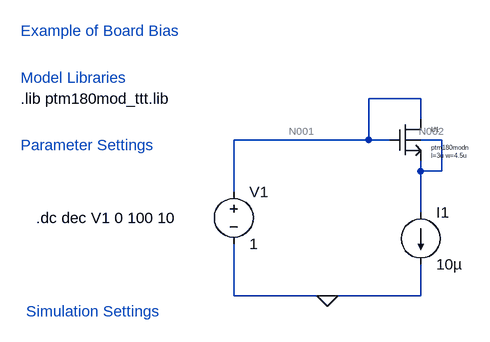
[diagram p0: schematic board_bias.asc]
board_bias.asc, the LTspice schematic file:
Version 4
SHEET 1 3284 784
WIRE 256 -96 176 -96
WIRE 256 -64 256 -96
WIRE 176 -32 176 -96
WIRE 176 -32 -32 -32
WIRE 208 -32 176 -32
WIRE 288 -32 256 -32
WIRE 256 16 256 0
WIRE 288 16 288 -32
WIRE 288 16 256 16
WIRE -32 48 -32 -32
WIRE 256 80 256 16
WIRE -32 208 -32 128
WIRE 112 208 -32 208
WIRE 256 208 256 160
WIRE 256 208 112 208
FLAG 112 208 0
SYMBOL cnm25mod_nmos4 208 -64 R0
SYMATTR SpiceModel ptm180modn
SYMATTR InstName U1
SYMBOL voltage -32 32 R0
SYMATTR InstName V1
SYMATTR Value 1
SYMBOL current 256 80 R0
SYMATTR InstName I1
SYMATTR Value 10µ
TEXT -360 -24 Left 2 ;Parameter Settings
TEXT -352 232 Left 2 ;Simulation Settings
TEXT -360 -128 Left 2 ;Model Libraries
TEXT -360 -200 Left 2 ;Example of Board Bias
TEXT -360 -96 Left 2 !.lib ptm180mod_ttt.lib
TEXT -336 88 Left 2 !.dc dec V1 0 100 10

The netlist it stands for:
* board_bias.asc
XU1 N001 N001 N002 N002 ptm180modn l=3u w=4.5u  ; pins D G S B
V1 N001 0 1
I1 N002 0 10µ
* Parameter Settings
* Simulation Settings
* Model Libraries
* Example of Board Bias
.lib ptm180mod_ttt.lib
.dc dec V1 0 100 10
.backanno
.end

* Results of the author's LTspice run, read from the files saved beside the schematic
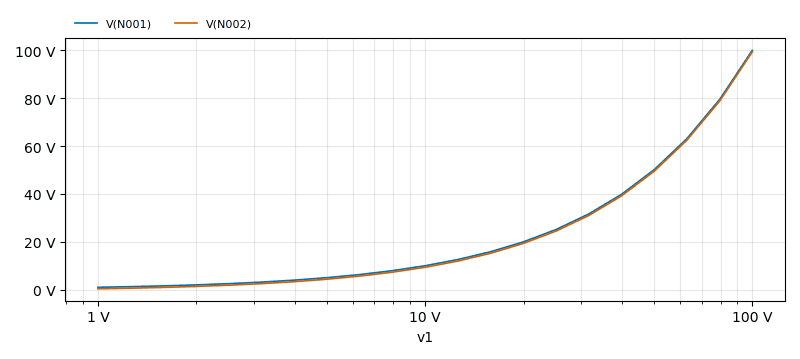
[diagram p1: DC transfer characteristic of board_bias.asc, plotted from the saved traces]
* DC transfer characteristic, 1 run:
*   V(N001): 1 V at v1=1 V, 100 V at v1=100 V, min 1 V, max 100 V
*   V(N002): 364.1 mV at v1=1 V, 99.36 V at v1=100 V, min 364.1 mV, max 99.36 V